# EAGLE design USBMidiBreakout (EAGLE 6.1)
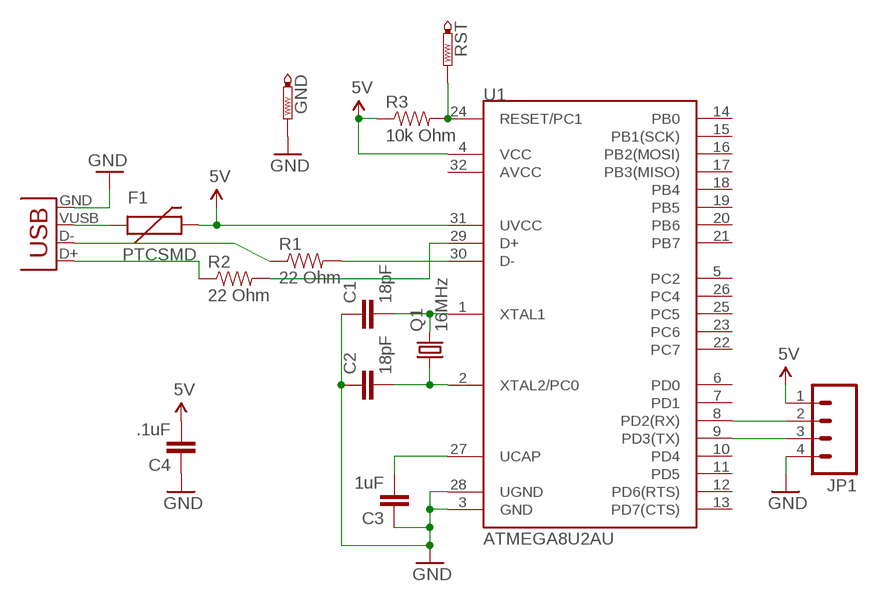
[diagram p0: schematic, sheet 1]

## Parts
C1  18pF  CAP1206  [1206]
C2  18pF  CAP1206  [1206]
C3  1uF  CAP1206  [1206]
C4  .1uF  CAP1206  [1206]
F1  PTCSMD  [PTC-1206]
GND  PTR1B1,27  [B1,27]
JP1  M04PTH  [1X04]
Q1  16MHz  CRYSTALHC49UP  [HC49UP]
R1  22 Ohm  RESISTOR1206  [1206]
R2  22 Ohm  RESISTOR1206  [1206]
R3  10k Ohm  RESISTOR1206  [1206]
RST  PTR1B1,27  [B1,27]
U1  ATMEGA8U2AU  [TQFP32-08]
X1  USB-B-S  [USB-B-SMT]

## Nets
5V: C4.2 F1.2 JP1.1 R3.1 U1.4(VCC) U1.31(UVCC)
GND: C1.1 C2.1 C3.1 C4.1 GND.TP JP1.4 U1.3(GND) U1.28(UGND) X1.GND
N$1: C3.2 U1.27(UCAP)
N$2: C1.2 Q1.2 U1.1(XTAL1)
N$3: C2.2 Q1.1 U1.2(XTAL2/PC0)
N$4: F1.1 X1.VUSB(VBUS)
N$5: R1.1 X1.D-
N$6: R2.1 X1.D+
N$7: JP1.2 U1.8(PD2(RX))
N$8: JP1.3 U1.9(PD3(TX))
N$9: R2.2 U1.29(D+)
N$10: R1.2 U1.30(D-)
N$11: R3.2 RST.TP U1.24(RESET/PC1)
Unconnected: U1.5(PC2) U1.6(PD0) U1.7(PD1) U1.10(PD4) U1.11(PD5) U1.12(PD6(RTS)) U1.13(PD7(CTS)) U1.14(PB0) U1.15(PB1(SCK)) U1.16(PB2(MOSI)) U1.17(PB3(MISO)) U1.18(PB4) U1.19(PB5) U1.20(PB6) U1.21(PB7) U1.22(PC7) U1.23(PC6) U1.25(PC5) U1.26(PC4) U1.32(AVCC)

## Library data of the parts
C1-C4 = SparkFun:CAP: Capacitor Standard 0603 ceramic capacitor, and 0.1" leaded capacitor.
F1 = SparkFun:PTC: Resettable Fuse PTC Resettable Fuse. Spark Fun Electronics SKU : COM-08357
GND RST = testpad:PTR1: TEST PIN
JP1 = SparkFun:M04: Header 4 Standard 4-pin 0.1" header. Use with straight break away headers (SKU : PRT-00116), right angle break away headers (PRT-00553), swiss pins (PRT-00743), machine pins (PRT-00117), and female headers (PRT-00115). Molex polarized connector foot print use with SKU : PRT-08231 with associated crimp pins and housings. 1MM SMD Version SKU: PRT-10208
Q1 = crystal:CRYSTAL: CRYSTAL; OC_FARNELL: unknown; OC_NEWARK: unknown
R1-R3 = SparkFun:RESISTOR: Resistor Basic schematic elements and footprints for 0603, 1206, and PTH resistors.
U1 = SparkFun:ATMEGA8U2: Atmel 8-bit Microcontroller with 8/16/32K Bystes of ISP Flash and USB Controller. ATmega8U2, ATmega16U2, and ATmega32U2
X1 = SparkFun:USB: USB Connectors USB-B-PTH is fully proven SKU : PRT-00139 USB-miniB is fully proven SKU : PRT-00587 USB-A-PCB is untested. USB-A-H is throughly reviewed, but untested. Spark Fun Electronics SKU : PRT-00437 USB-B-SMT is throughly reviewed, but untested. Needs silkscreen touching up. USB-A-S has not been used/tested USB-MB-H has not been used/tested

## Board
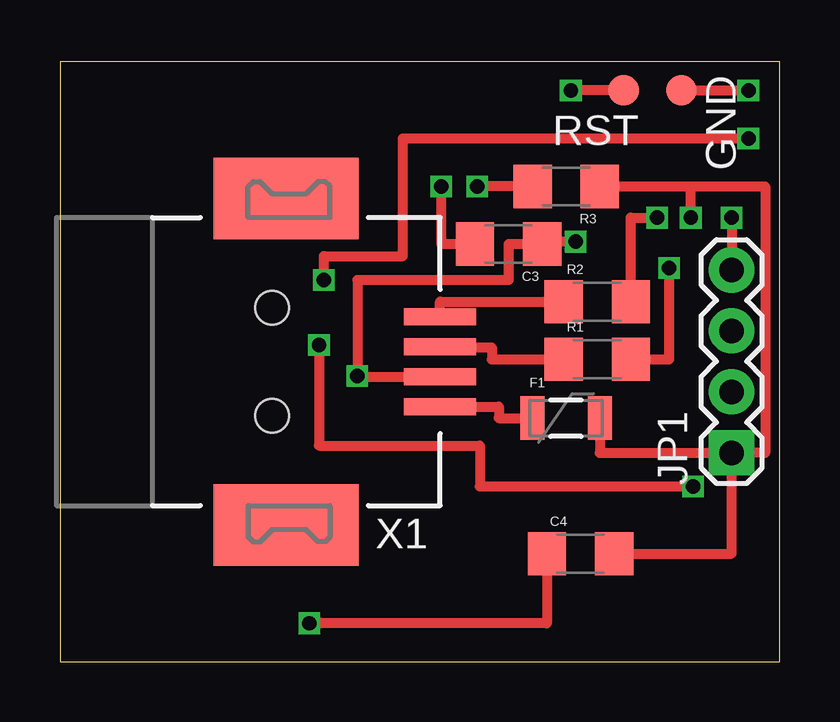
[diagram p1: board, top side]
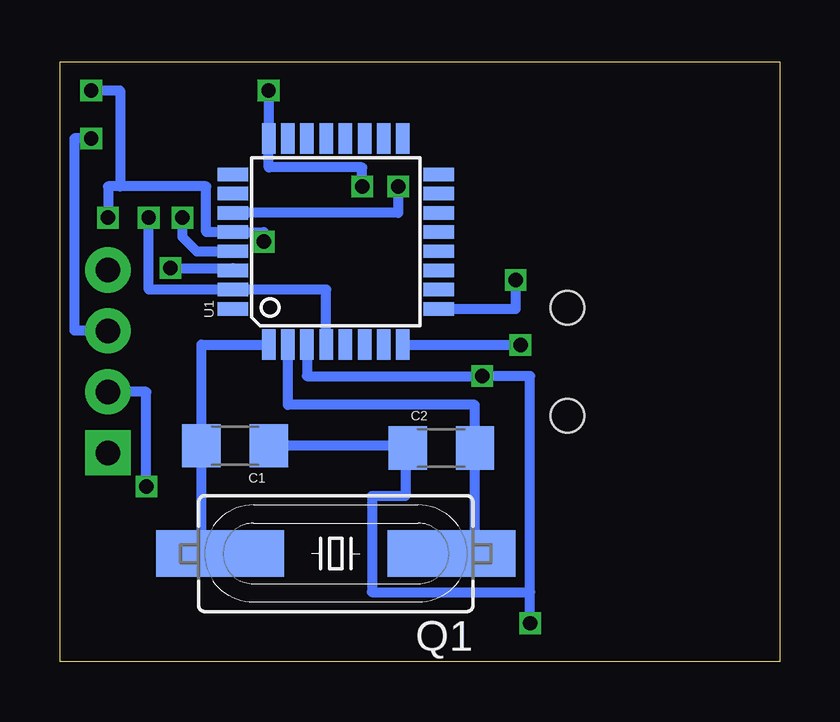
[diagram p2: board, bottom side, seen from below]

Size 30 x 25 mm. Coordinates in mm from the lower left corner, seen from the top.
Outline: 0,0 30,0 30,25 0,25 0,0
Copper layers (1*16): Top 0.035mm / dielectric 1.5mm / Bottom 0.035mm
Design rules: minimum track width 6mil, minimum drill 12mil, track to track 6mil, track to pad 6mil, pad to pad 6mil, via to via 6mil, smd to smd 0mil, copper to edge 10mil, drill to drill 10mil, minimum pad ring 10mil, minimum via ring 6mil, stop-mask expansion 2mil, vias tented up to drill 100mil, thermal gap 10mil

### Footprints (pad centres in the part's own frame; a part is rotated, then mirrored left to right if it is on the bottom)
1206 = smd 1.6 x 1.8: 1 -1.4,0; 2 1.4,0
PTC-1206 = smd 1 x 1.8: 1 -1.4,0; 2 1.4,0
B1,27 = smd 1.27 x 1.27: TP 0,0
1X04 = drill 1.016 pad 1.88 square: 1 0,0 | drill 1.016 pad 1.88: 2 2.54,0; 3 5.08,0; 4 7.62,0
HC49UP = smd 5.334 x 1.93: 1 -4.826,0; 2 4.826,0
TQFP32-08 = smd 1.27 x 0.559: 1 -4.293,2.8; 2 -4.293,2; 3 -4.293,1.2; 4 -4.293,0.4; 5 -4.293,-0.4; 6 -4.293,-1.2; 7 -4.293,-2; 8 -4.293,-2.8; 17 4.293,-2.8; 18 4.293,-2; 19 4.293,-1.2; 20 4.293,-0.4; 21 4.293,0.4; 22 4.293,1.2; 23 4.293,2; 24 4.293,2.8 | smd 0.559 x 1.27: 9 -2.8,-4.293; 10 -2,-4.293; 11 -1.2,-4.293; 12 -0.4,-4.293; 13 0.4,-4.293; 14 1.2,-4.293; 15 2,-4.293; 16 2.8,-4.293; 25 2.8,4.293; 26 2,4.293; 27 1.2,4.293; 28 0.4,4.293; 29 -0.4,4.293; 30 -1.2,4.293; 31 -2,4.293; 32 -2.8,4.293
USB-B-SMT = smd 6.04 x 3.4: 5 0.58,6.8; 6 0.58,-6.8 | smd 3 x 0.7: D+ 7,1.875; D- 7,0.625; GND 7,-0.625; VUSB 7,-1.875 | hole 1.4: 0,2.25; 0,-2.25

### Placement (x,y rotation side)
C1  22.7,9 180 bottom
C2  14.1,8.9 0 bottom
C3  18.7,17.4 180 top
C4  21.7,4.5 0 top
F1  21.1,10.15 0 top
GND  25.9,23.8 270 top
JP1  28,8.7 90 top
Q1  18.5,4.5 180 bottom
R1  22.4,12.6 0 top
R2  22.4,15 0 top
R3  21.1,19.8 180 top
RST  23.5,23.8 180 top
U1  18.5,17.5 90 bottom
X1  8.85,12.5 0 top

### Tracks (layer width: path | path; a pad name or v marks a point on that pad's centre or on a via)
5V  (via drill 0.6)
  Top 0.406: F1.2 22.5,8.7 JP1.1 | R3.1 26.3,19.8 | 26.3,19.8 29.4,19.8 29.4,8.7 JP1.1 | v26.3,18.5 26.3,19.8 | C4.2 28,4.5 JP1.1
  Bottom 0.406: U1.4 18.9,15.5 U1.31 26.3,15.5 v26.3,18.5
GND  (via drill 0.6)
  Top 0.406: X1.GND 12.4,11.88 v12.4,11.9 12.4,15.9 18.7,15.9 18.7,17.4 C3.1 20.1,17.5 v21.5,17.5 | v28,18.5 JP1.4 | GND.TP v28.7,23.8 | C4.1 20.3,1.6 v10.4,1.6
  Bottom 0.406: C2.1 arc-90 15.6,9 | 15.6,9 C1.1 | U1.3 19.7,11.9 v12.4,11.9 10.4,11.9 10.4,2.9 | 15.6,9 15.6,6.9 17,6.9 17,2.9 10.4,2.9 | 27.5,19.8 23.9,19.8 23.9,17.9 U1.28 21.5,17.9 v21.5,17.5 | 27.5,19.8 28,19.8 v28,18.5 | v28.7,23.8 27.5,23.8 27.5,19.8 | v10.4,1.6 10.4,2.9
N$1  (via drill 0.6)
  Top 0.406: C3.2 15.9,17.4 v15.9,19.8
  Bottom 0.406: v15.9,19.8 15.9,18.7 U1.27
N$2
  Bottom 0.406: Q1.2 arc90 24.1,5.27 C1.2 24.1,13.21 U1.1
N$3
  Bottom 0.406: Q1.1 arc-90 12.7,5.47 C2.2 12.7,10.7 20.5,10.7 U1.2
N$4
  Top 0.406: X1.VUSB 18.3,10.62 18.3,10.15 F1.1
N$5
  Top 0.406: X1.D- 15.85,13.1 18,13.1 18,12.6 R1.1
N$6
  Top 0.406: X1.D+ 15.85,15 R2.1
N$7  (via drill 0.6)
  Top 0.406: v10.8,13.2 10.8,9 17.5,9 17.5,7.3 v26.4,7.3
  Bottom 0.406: U1.8 v10.8,13.21 v10.8,13.2 | v26.4,7.3 26.4,11.24 JP1.2
N$8  (via drill 0.6)
  Top 0.406: v11,15.9 11,16.9 14.3,16.9 14.3,21.8 v28.7,21.8
  Bottom 0.406: U1.9 11,14.7 v11,15.9 | v28.7,21.8 29.4,21.8 29.4,13.8 28,13.8 JP1.3
N$9  (via drill 0.6)
  Top 0.406: R2.2 23.8,18.5 v24.9,18.5
  Bottom 0.406: v24.9,18.5 24.9,17.7 24.3,17.1 U1.29
N$10  (via drill 0.6)
  Top 0.406: R1.2 25.4,12.6 v25.4,16.4
  Bottom 0.406: v25.4,16.4 22.79,16.4 U1.30
N$11  (via drill 0.6)
  Top 0.406: R3.2 v17.4,19.8 | RST.TP v21.3,23.8
  Bottom 0.406: v17.4,19.8 17.4,20.6 21.3,20.6 U1.24 v21.3,23.8